# EAGLE design Carte usb 0.8 (EAGLE 7.2.0)
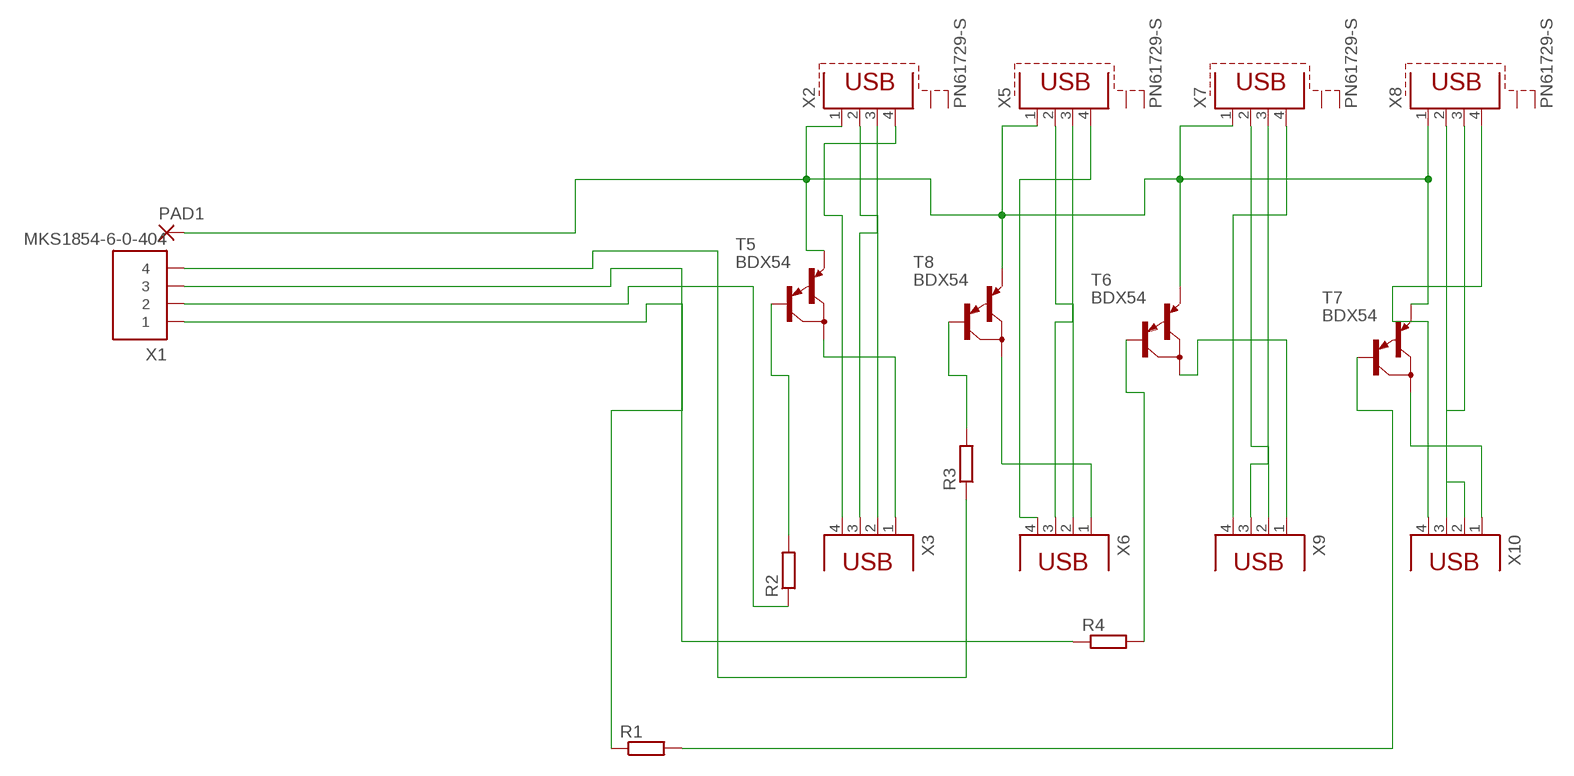
[diagram p0: schematic, sheet 1]

## Parts
PAD1  2,54/1,1  [2,54/1,1]
R1  R-EU_0207/10  [0207/10]
R2  R-EU_0207/10  [0207/10]
R3  R-EU_0207/10  [0207/10]
R4  R-EU_0207/10  [0207/10]
T5  BDX54  [TO220]
T6  BDX54  [TO220]
T7  BDX54  [TO220]
T8  BDX54  [TO220]
X1  MKS1854-6-0-404  [MKS1854-6-0-404]
X2  PN61729-S  [PN61729-S]
X3  PN87520  [PN87520]
X5  PN61729-S  [PN61729-S]
X6  PN87520  [PN87520]
X7  PN61729-S  [PN61729-S]
X8  PN61729-S  [PN61729-S]
X9  PN87520  [PN87520]
X10  PN87520  [PN87520]

## Nets
N$1: R2.2 T5.1(B)
N$2: R3.2 T8.1(B)
N$4: X2.2 X3.2
N$5: R4.2 T6.1(B)
N$7: X2.3 X3.3
N$8: X5.3 X6.3
N$9: T8.2(C) X6.1
N$10: X5.2 X6.2
N$12: X7.2 X9.2
N$13: X2.4 X3.4
N$14: X7.3 X9.3
N$15: PAD1.1(P) T5.3(E) T6.3(E) T7.3(E) T8.3(E) X2.1 X5.1 X7.1 X8.1
N$16: X8.2 X10.2
N$17: X8.3 X10.3
N$18: X8.4 X10.4
N$19: X5.4 X6.4
N$20: T6.2(C) X9.1
N$21: T7.2(C) X10.1
N$22: X7.4 X9.4
N$25: T5.2(C) X3.1
N$29: R1.2 T7.1(B)
N$30: R1.1 X1.1
N$31: R2.1 X1.2
N$32: R4.1 X1.3
N$33: R3.1 X1.4
Unconnected: X2.S1 X2.S2 X5.S1 X5.S2 X7.S1 X7.S2 X8.S1 X8.S2

## Library data of the parts
PAD1 = wirepad:2,54/1,1: THROUGH-HOLE PAD
R1-R4 = rcl:R-EU_: RESISTOR, European symbol
T5-T8 = transistor:BDX54: PNP BIPOLAR DARLINGTON TRANSISTOR Source: http://www.datasheetcatalog.org/datasheet/mospec/BDX54.pdf
X1 = con-stocko:MKS1854-6-0-404: Serie MKS 1850 Lötstifte In-line, Raster 2.5 mm, Stiftwannen, stehend, mit Rastlasche Source: http://www.stocko.de/de/index.php?seite=ka_rfk2_mks1850.html&rubrik=Katalog+-+RFK+2 rfk_1850.pdf; OC_FARNELL: 1141862; OC_NEWARK: unknown
X2 X5 X7 X8 = con-berg:PN61729-S: BERG USB connector; OC_FARNELL: unknown; OC_NEWARK: unknown
X3 X6 X9 X10 = con-berg:PN87520: BERG USB connector; OC_FARNELL: unknown; OC_NEWARK: unknown

## Net classes
0 default: width 0.8 mm

## Board
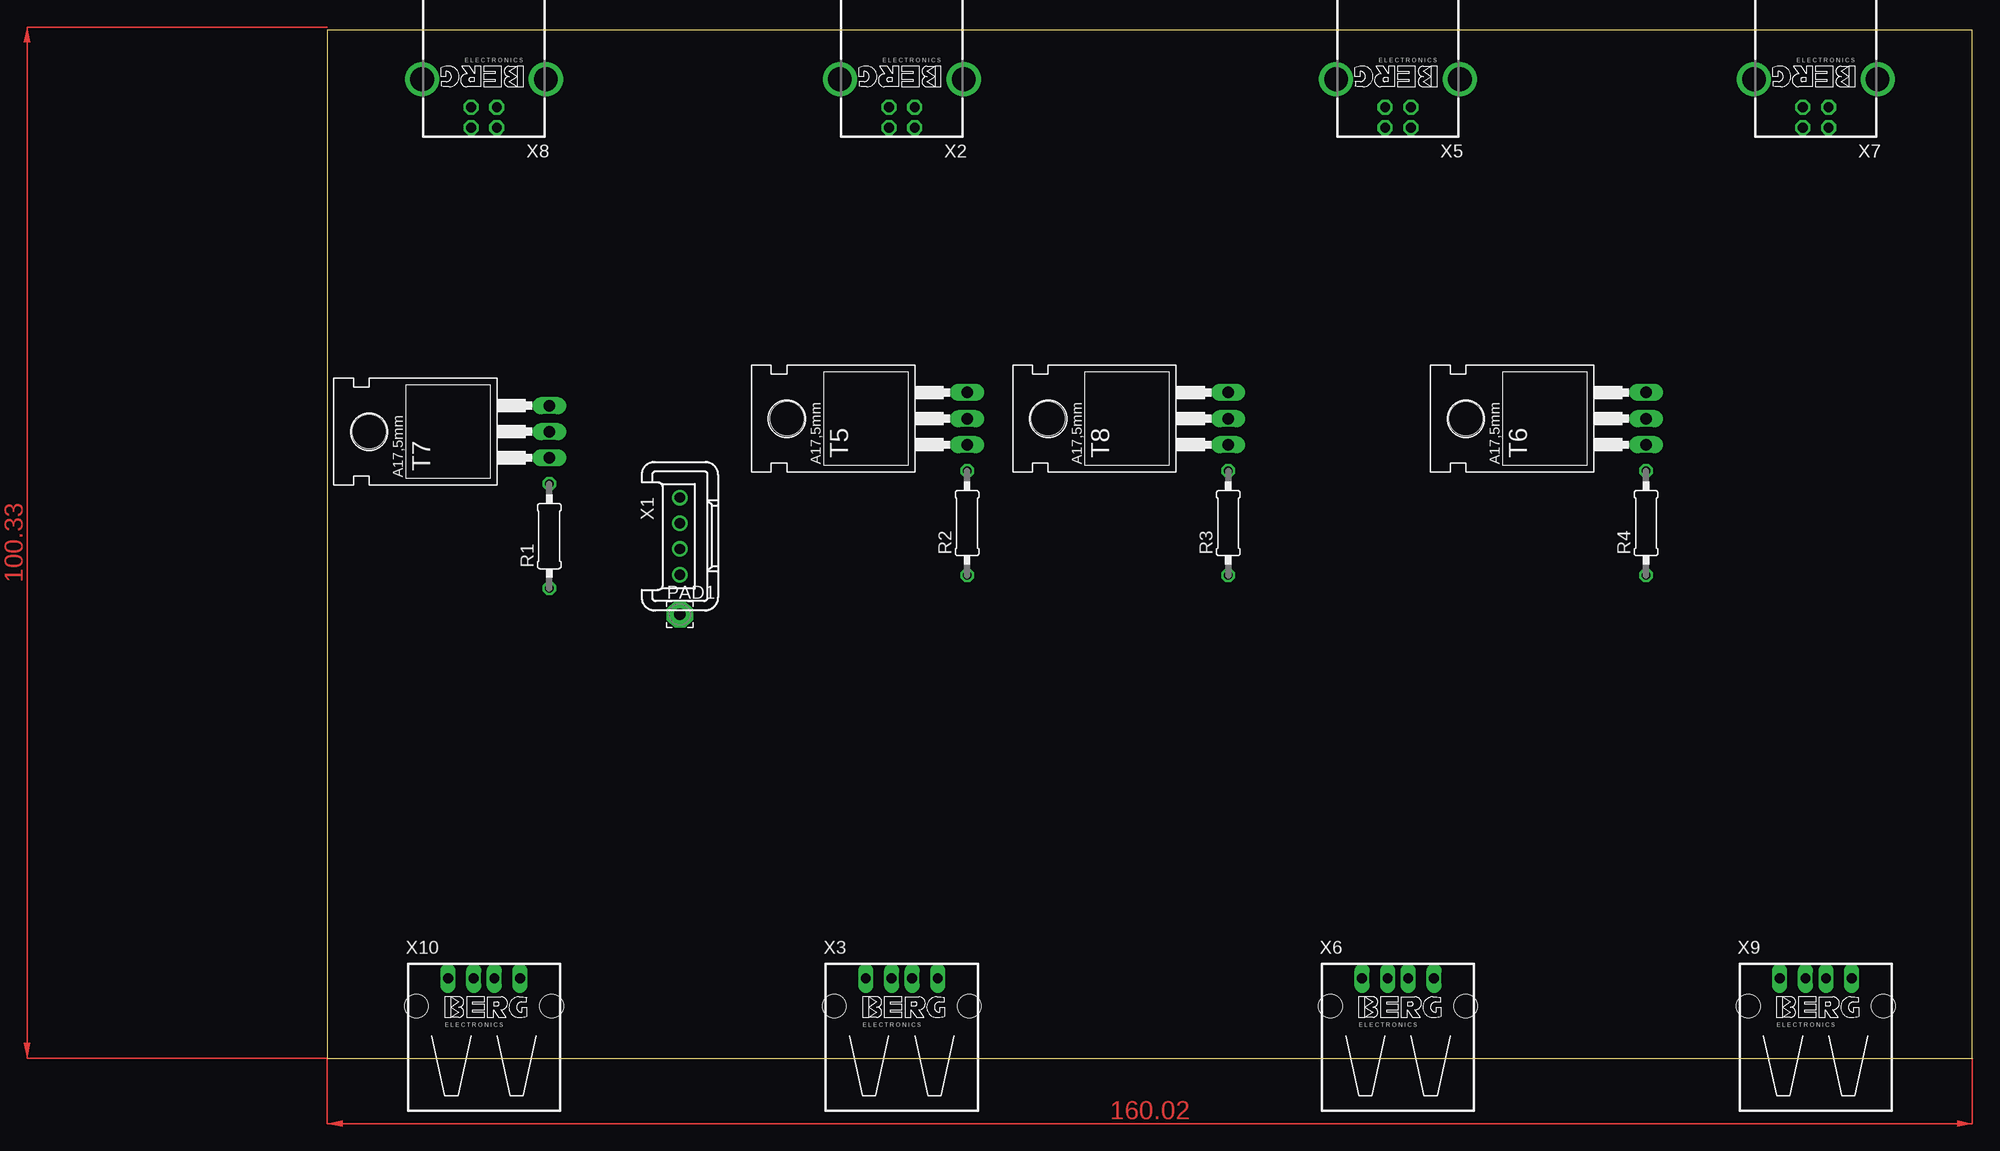
[diagram p1: board, top side]
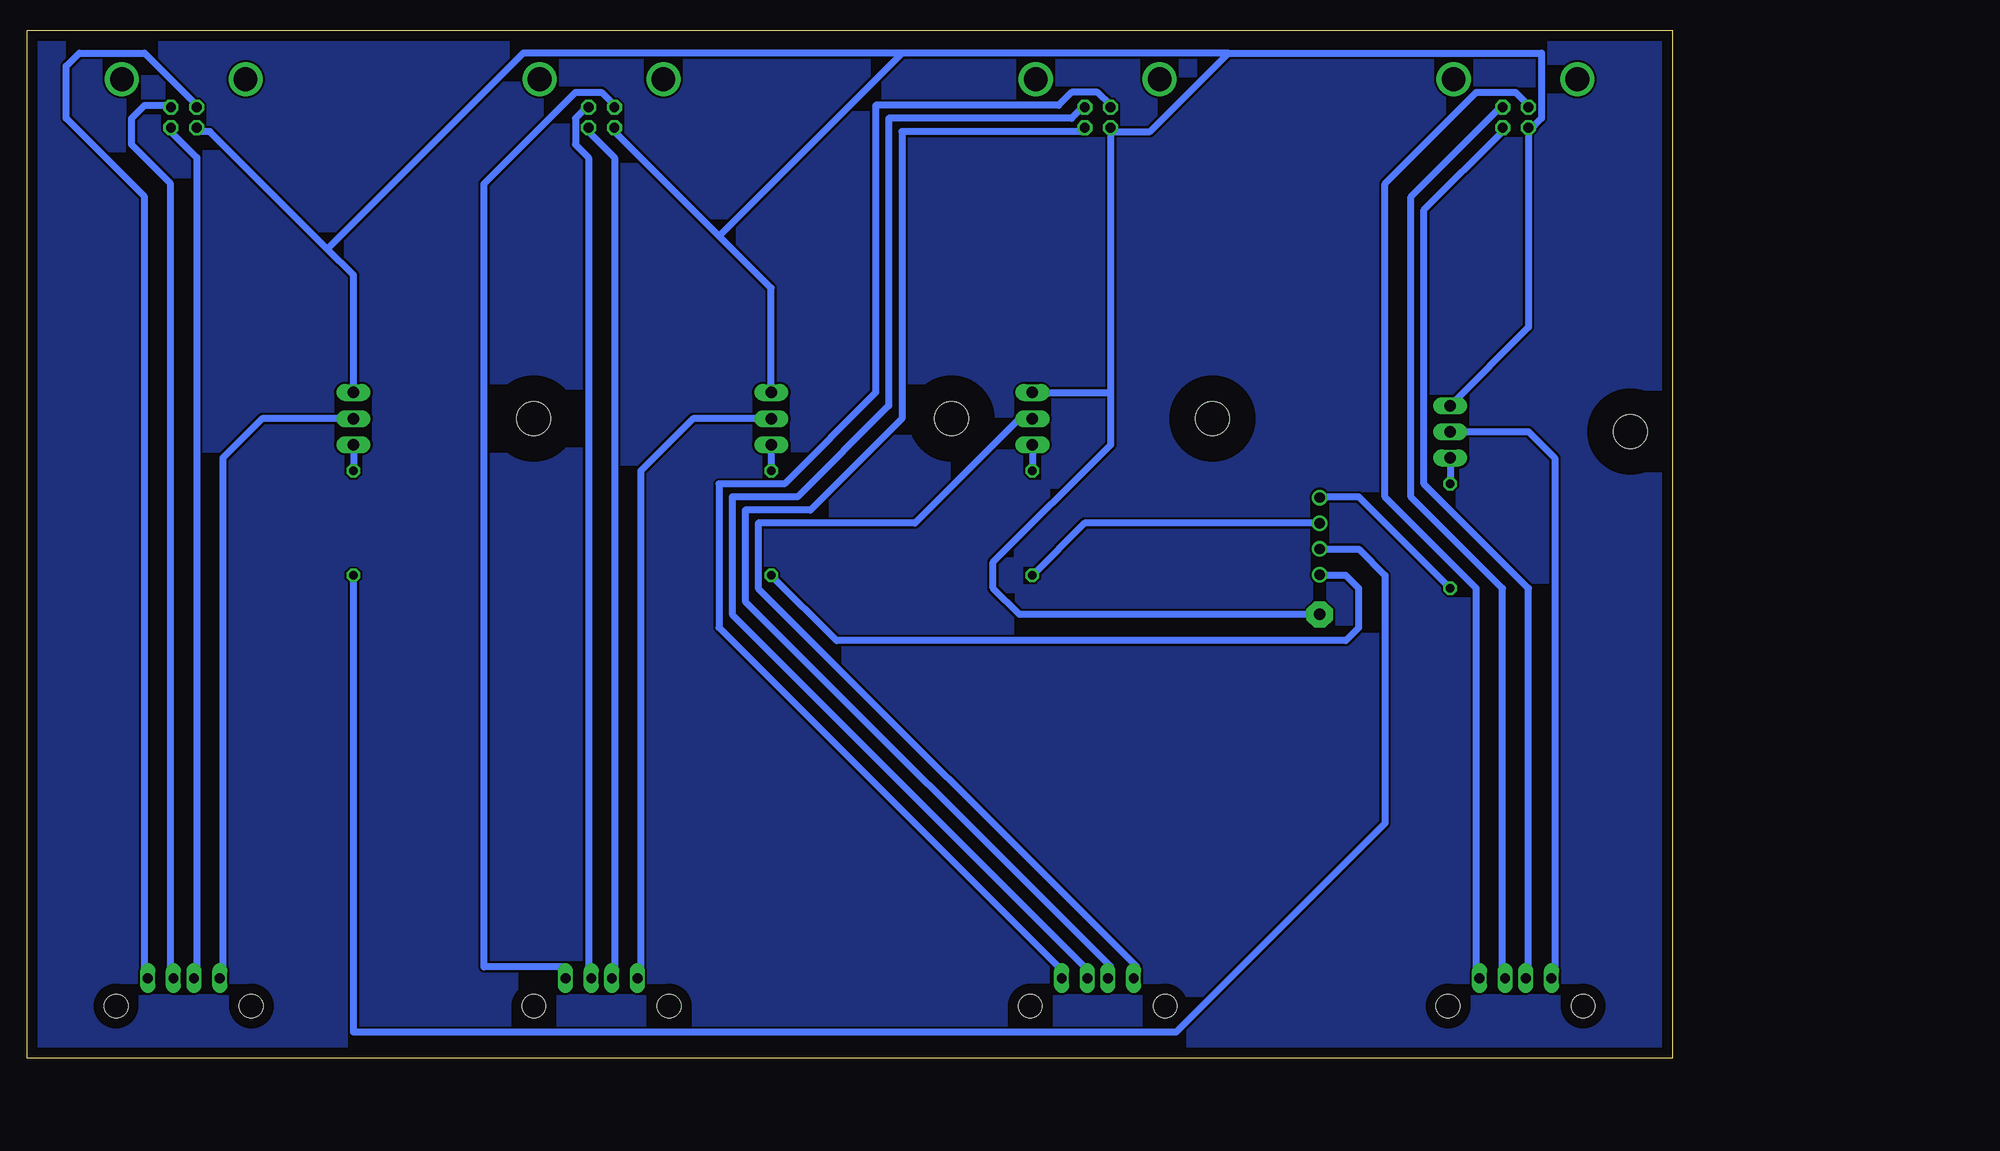
[diagram p2: board, bottom side, seen from below]

Size 160 x 100 mm. Coordinates in mm from the lower left corner, seen from the top.
Outline: 0,0 160,0 160,100 0,100 0,0
Copper layers (1*16): Top 0.035mm / dielectric 1.5mm / Bottom 0.035mm
Design rules "default": minimum track width 10mil, minimum drill 24mil, track to track 8mil, track to pad 8mil, pad to pad 8mil, via to via 8mil, smd to smd 8mil, copper to edge 40mil, drill to drill 8mil, minimum pad ring 10mil, minimum via ring 8mil, stop-mask expansion 4mil, vias tented up to drill 0mil, thermal gap 10mil

### Footprints (pad centres in the part's own frame; a part is rotated, then mirrored left to right if it is on the bottom)
2,54/1,1 = drill 1.118 pad 2.54 octagon: 1 0,0
0207/10 = drill 0.813 octagon: 1 -5.08,0; 2 5.08,0
TO220 = drill 1.118 long: 1 -2.54,-6.35; 2 0,-6.35; 3 2.54,-6.35 | hole 3.302: 0,11.176
MKS1854-6-0-404 = drill 1 pad 1.422: 1 -3.75,0; 2 -1.25,0; 3 1.25,0; 4 3.75,0
PN61729-S = drill 0.95 octagon: 1 1.25,4.71; 2 -1.25,4.71; 3 -1.25,2.71; 4 1.25,2.71 | drill 2.3 pad 2.9: S1 -6.02,0; S2 6.02,0
PN87520 = drill 0.95 long: 1 -3.5,2.71; 2 -1,2.71; 3 1,2.71; 4 3.5,2.71 | hole 2.3: -6.57,0; 6.57,0

### Placement (x,y rotation side)
PAD1  34.29,43.18 0 top
R1  21.59,50.8 90 top
R2  62.23,52.07 90 top
R3  87.63,52.07 90 top
R4  128.27,52.07 90 top
T5  55.88,62.23 90 top
T6  121.92,62.23 90 top
T7  15.24,60.96 90 top
T8  81.28,62.23 90 top
X1  34.29,50.8 270 top
X2  55.88,95.25 180 top
X3  55.88,5.08 0 top
X5  104.14,95.25 180 top
X6  104.14,5.08 0 top
X7  144.78,95.25 180 top
X8  15.24,95.25 180 top
X9  144.78,5.08 0 top
X10  15.24,5.08 0 top

### Tracks (layer width: path | path; a pad name or v marks a point on that pad's centre or on a via)
N$1
  Bottom 0.7: T5.1 R2.2
N$2
  Bottom 0.7: T8.1 R3.2
N$3
  pour Bottom: 0,100.33 160.02,100.33 160.02,0 0,0
N$4
  Bottom 0.7: X3.2 54.61,8.89 90.17,44.45 90.17,53.34 83.82,53.34 74.93,62.23 74.93,90.17 57.15,90.17 X2.2
N$5
  Bottom 0.7: T6.1 R4.2
N$7
  Bottom 0.7: X3.3 57.15,8.89 91.44,43.18 91.44,54.61 85.09,54.61 76.2,63.5 76.2,91.44 58.42,91.44 57.15,92.71 X2.3
N$8
  Bottom 0.7: X6.3 105.41,8.89 105.41,87.63 106.68,88.9 106.68,91.44 105.41,92.71 X5.3
N$9
  Bottom 0.7: X6.1 100.33,8.89 100.33,57.15 95.25,62.23 T8.2
N$10
  Bottom 0.7: X6.2 102.87,8.89 102.87,87.63 105.41,90.17 X5.2
N$12
  Bottom 0.7: X9.2 143.51,8.89 143.51,87.63 146.05,90.17 X7.2
N$13
  Bottom 0.7: X3.4 59.69,8.89 92.71,41.91 92.71,55.88 86.36,55.88 77.47,64.77 77.47,92.71 59.69,92.71 58.42,93.98 55.88,93.98 54.61,92.71 X2.4
N$14
  Bottom 0.7: X9.3 146.05,8.89 146.05,85.09 149.86,88.9 149.86,91.44 148.59,92.71 146.2,92.71 X7.3
N$15
  Bottom 0.7: 130.81,78.74 128.27,76.2 T6.3 | 130.81,78.74 142.24,90.17 143.51,90.17 X7.1 | 92.71,80.01 87.63,74.93 T8.3 | 92.71,80.01 102.87,90.17 X5.1 | 54.61,64.77 54.61,90.17 | T5.3 54.61,64.77 | 13.97,90.17 12.7,91.44 12.7,97.79 43.18,97.79 | 43.18,97.79 50.8,90.17 54.61,90.17 | 13.97,90.17 X8.1 | 54.61,90.17 X2.1 | 74.93,97.79 92.71,80.01 | 43.18,97.79 74.93,97.79 | 130.81,78.74 111.76,97.79 74.93,97.79 | PAD1.1 63.5,43.18 66.04,45.72 66.04,48.26 54.61,59.69 54.61,64.77 | 13.97,90.17 13.97,71.12 T7.3
N$16
  Bottom 0.7: X10.2 13.97,8.89 13.97,45.72 24.13,55.88 24.13,82.55 16.51,90.17 X8.2
N$17
  Bottom 0.7: X10.3 16.51,8.89 16.51,45.72 25.4,54.61 25.4,83.82 16.51,92.71 X8.3
N$18
  Bottom 0.7: X8.4 13.97,92.71 15.24,93.98 19.05,93.98 27.94,85.09 27.94,54.61 19.05,45.72 19.05,8.89 X10.4
N$19
  Bottom 0.7: X5.4 102.87,92.71 104.14,93.98 106.68,93.98 115.57,85.09 115.57,8.89 107.95,8.89 X6.4
N$20
  Bottom 0.7: 140.97,8.89 141.06,8.56 | 141.06,8.56 X9.1 | T6.2 137.16,62.23 140.97,58.42 140.97,8.65 141.06,8.56
N$21
  Bottom 0.7: X10.1 11.43,8.89 11.43,58.42 13.97,60.96 T7.2
N$22
  Bottom 0.7: X9.4 148.59,8.89 148.59,83.82 156.21,91.44 156.21,96.52 154.94,97.79 148.59,97.79 143.51,92.71 X7.4
N$25
  Bottom 0.7: T5.2 63.5,62.23 73.66,52.07 88.9,52.07 88.9,45.72 52.07,8.89 X3.1
N$29
  Bottom 0.7: T7.1 R1.2
N$30
  Bottom 0.7: 34.29,54.61 X1.1 34.23,54.61 30.48,54.61 R1.1
N$31
  Bottom 0.7: R2.1 57.15,52.07 34.29,52.07 X1.2
N$32
  Bottom 0.7: R4.1 128.27,2.54 48.26,2.54 27.94,22.86 27.94,46.99 30.48,49.53 34.29,49.53 X1.3
N$33
  Bottom 0.7: R3.1 81.28,40.64 31.75,40.64 30.48,41.91 30.48,45.72 31.75,46.99 34.23,46.99 X1.4 34.29,46.99
(copper drawn outside any net)
  shapes: Top area x2